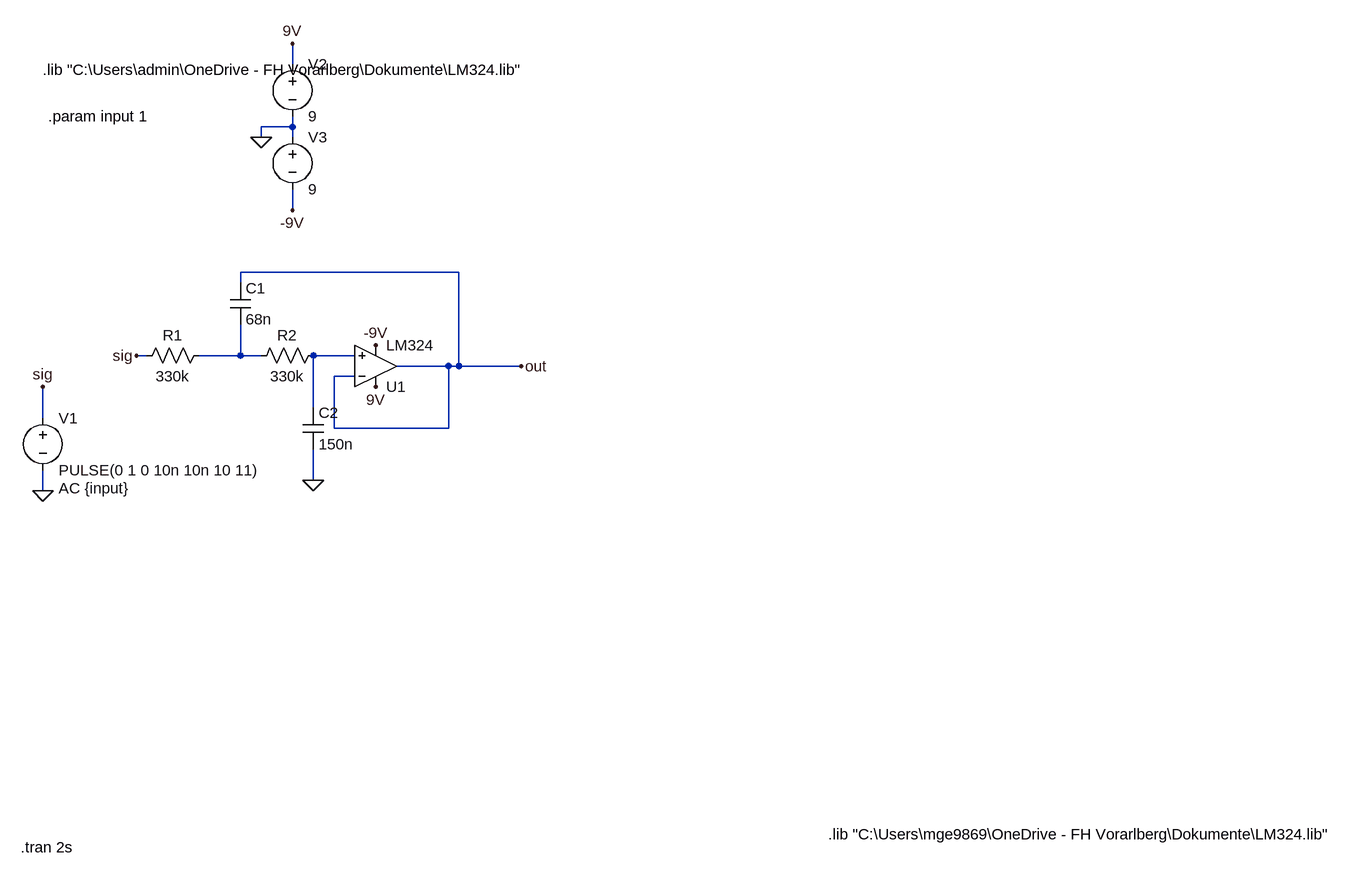
[diagram p0: schematic MessverstaerkerLab7.asc]
MessverstaerkerLab7.asc, the LTspice schematic file:
Version 4
SHEET 1 2032 772
WIRE 336 -448 336 -480
WIRE 336 -352 336 -368
WIRE 336 -352 288 -352
WIRE 288 -336 288 -352
WIRE 336 -336 336 -352
WIRE 336 -224 336 -256
WIRE 592 -128 256 -128
WIRE 256 -112 256 -128
WIRE 112 0 96 0
WIRE 256 0 256 -48
WIRE 256 0 192 0
WIRE 288 0 256 0
WIRE 432 0 368 0
WIRE 576 16 496 16
WIRE 592 16 592 -128
WIRE 592 16 576 16
WIRE 688 16 592 16
WIRE 432 32 400 32
WIRE 368 80 368 0
WIRE -48 96 -48 48
WIRE 400 112 400 32
WIRE 576 112 576 16
WIRE 576 112 400 112
WIRE 368 192 368 144
WIRE -48 208 -48 176
FLAG 288 -336 0
FLAG 336 -224 -9V
FLAG 336 -480 9V
FLAG -48 208 0
FLAG -48 48 sig
FLAG 688 16 out
FLAG 464 48 9V
FLAG 464 -16 -9V
FLAG 368 192 0
FLAG 96 0 sig
SYMBOL voltage -48 80 R0
WINDOW 123 24 124 Left 2
WINDOW 39 24 124 Left 2
SYMATTR Value2 AC {input}
SYMATTR InstName V1
SYMATTR Value PULSE(0 1 0 10n 10n 10 11)
SYMBOL voltage 336 -464 R0
WINDOW 123 0 0 Left 0
WINDOW 39 0 0 Left 0
SYMATTR InstName V2
SYMATTR Value 9
SYMBOL voltage 336 -352 R0
WINDOW 123 0 0 Left 0
WINDOW 39 0 0 Left 0
SYMATTR InstName V3
SYMATTR Value 9
SYMBOL OpAmps\\opamp2 464 80 M180
SYMATTR InstName U1
SYMATTR Value LM324
SYMBOL res 208 -16 R90
WINDOW 0 0 56 VBottom 2
WINDOW 3 32 56 VTop 2
SYMATTR InstName R1
SYMATTR Value 330k
SYMBOL res 384 -16 R90
WINDOW 0 0 56 VBottom 2
WINDOW 3 32 56 VTop 2
SYMATTR InstName R2
SYMATTR Value 330k
SYMBOL cap 240 -112 R0
SYMATTR InstName C1
SYMATTR Value 68n
SYMBOL cap 352 80 R0
SYMATTR InstName C2
SYMATTR Value 150n
TEXT 1160 736 Left 2 !.lib "C:\\Users\\mge9869\\OneDrive - FH Vorarlberg\\Dokumente\\LM324.lib"
TEXT -40 -368 Left 2 !.param input 1
TEXT -82 756 Left 2 !.tran 2s
TEXT -48 -440 Left 2 !.lib "C:\\Users\\admin\\OneDrive - FH Vorarlberg\\Dokumente\\LM324.lib"

The netlist it stands for:
* MessverstaerkerLab7.asc
V1 sig 0 PULSE(0 1 0 10n 10n 10 11) AC {input}
V2 9V 0 9
V3 0 -9V 9
XU1 N002 out 9V -9V out LM324  ; pins In+ In- V+ V- OUT
R1 N001 sig 330k
R2 N002 N001 330k
C1 out N001 68n
C2 N002 0 150n
.lib "C:\Users\mge9869\OneDrive - FH Vorarlberg\Dokumente\LM324.lib"
.param input 1
.tran 2s
.lib "C:\Users\admin\OneDrive - FH Vorarlberg\Dokumente\LM324.lib"
.backanno
.end